# Altium schematic sheet CV060_POWER.SchDoc
size A4
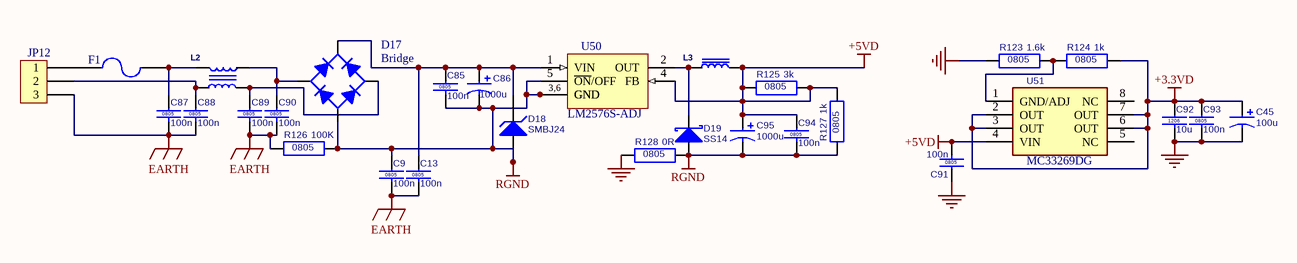
[diagram p0: CV060_POWER.SchDoc]

## Parts
C9  Case: 0805  [RC0805]  (hidden comment: 100n)
C13  Case: 0805  [RC0805]  (hidden comment: 100n)
C45  100u  [CEH12.5D5P2.5]
C85  Case: 0805  [RC0805]  (hidden comment: 100n)
C86  1000u  [CEH25D18P7.5]
C87  Case: 0805  [RC0805]  (hidden comment: 100n)
C88  Case: 0805  [RC0805]  (hidden comment: 100n)
C89  Case: 0805  [RC0805]  (hidden comment: 100n)
C90  Case: 0805  [RC0805]  (hidden comment: 100n)
C91  Case: 0805  [RC0805]  (hidden comment: 100n)
C92  Case: 1206  [RC1206]  (hidden comment: 10u)
C93  Case: 0805  [RC0805]  (hidden comment: 100n)
C94  Case: 0805  [RC0805]  (hidden comment: 100n)
C95  1000u  [CEH12.5D10P5.0]
D17  Bridge  [KBPM]
D18  Part Number: SMBJ24  [SMB]  (hidden comment: Zenner_diode)
D19  Part number: SS14  [SMA]  (hidden comment: Schottky_diode)
F1  RXEF135  [POLYSW_RXEF135]  (value not drawn)
JP12  Header 3pins  [PHENIX_5MM _3p3D]  (value not drawn)
L2  linear_filter1  [UU157-01]  (value not drawn)
L3  INDUCTOR2  [IH12.5D10P5.0]  (value not drawn)
R123  Case: 0805  [RC0805]  (hidden comment: 1.6k)
R124  Case: 0805  [RC0805]  (hidden comment: 1k)
R125  Case: 0805  [RC0805]  (hidden comment: 3k)
R126  Case: 0805  [RC0805]  (hidden comment: 100K)
R127  Case: 0805  [RC0805]  (hidden comment: 1k)
R128  Case: 0805  [RC0805]  (hidden comment: 0R)
U50  LM2576S-ADJ  [TO-263]
U51  MC33269DG  [SO-8]

## Nets
+3.3VD: C45.1 C92.1 C93.1 R124.2 U51.2(OUT) U51.3(OUT) U51.6(OUT) U51.7(OUT)
+5VD: C91.2 C94.1 C95.1 L3.2 R125.1 R125.2 R127.2 U50.4(FB) U51.4(VIN)
DGND: C45.2 C91.1 C92.2 C93.2 R123.1 R128.1
EARTH: C9.2 C13.2 C87.2 C88.2 C89.2 C90.2 JP12.3 R126.1
RGND: C9.1 C85.2 C86.2 C94.2 C95.2 D17.3(A) D18.2(A) D19.2(A) R126.2 R127.1 R128.2 U50.3(GND) U50.5(~{ON}/OFF) U50.6(GND)
NetC13_1: C13.1 C85.1 C86.1 D17.1(K) D18.1(K) U50.1(VIN)
NetC87_1: C87.1 F1.2 L2.1
NetC88_1: C88.1 JP12.2 L2.3
NetC89_1: C89.1 D17.2(C) L2.4
NetC90_1: C90.1 D17.4(C) L2.2
NetD19_1: D19.1(K) L3.1 U50.2(OUT)
NetF1_1: F1.1 JP12.1
NetR123_2: R123.2 R124.1 U51.1(GND/ADJ)

Not connected (* = marked no-connect by the designer): U51 5(NC) 8(NC)

## Notes on the sheet
- (in symbol LM2576S-ADJ) 3,6

## Library data of the parts
C9 C13 C85 C87-C91 C93 C94 = CC0805K-X5R-50V0-100N: Chip capacitor, 20p; Manufacturer: KEMET, YAGEO; Voltage: 50V; Tolerance: 10%; ROSH: Yes; Material: X5R; Package: 7" paper reel; Part number: CC0805K-X5R-50V0-100N; Suppliers: Avnet; Temperature: -55 - +125 C; Value: 100n; Supplier: Avnet-Abacus; Pb Free: Yes; Component Type: Standard; ComponentLink1Description: Manufacturer Link; ComponentLink2Description: Datasheet; ComponentLink2URL: http://www.yageo.com/pdf/UPY-GPHC_X5R_6.3V-to-50V_3.pdf; Published: 05.04.2010; Publisher: ppavlov
C45 = CEH12.5D5P2.5M-16V-100U: Electrolytic capacitor; Manufacturer: Panasonic; Manufacturer Part Number: C H12.5D5P2.5M-16V-100U; Voltage: 16V; Tolerance: 20%; Pb Free: Yes; Case: 12.5x5x2.5; Value: 100u; Part Number: CEH12.5D5P2.5M-16V-100U; Temperature: -55 - +105 C; Supplier: Megasan; MOQ: 500; Component Type: Standard; ComponentLink1Description: Manufacturer Link; ComponentLink2Description: Datasheet; ComponentLink2URL: http://industrial.panasonic.com/www-data/pdf/ABA0000/ABA0000CE22.pdf; Published: 11.12.2009; Publisher: ppavlov
C86 = CEH25D12.5P5.0M-50V-1000U: Electrolytic capacitor; Manufacturer: Panasonic; Voltage: 50V; Tolerance: 20%; Pb Free: Yes; Case: 25x18x7.5; Value: 1000u; Part Number: CEH25D12.5P5.0M-50V-1000U; Temperature: -55 - +105 C; Supplier: Megasan; Component Type: Standard; ComponentLink1Description: Manufacturer Link; ComponentLink2Description: Datasheet; Published: 29.06.2010; Publisher: ppavlov
C92 = CC1206K-X5R-10V0-10U0: Chip capacitor, 20p; Manufacturer: AVX; Manufacturer Part Number: AVX1206ZD106KAT2A; Voltage: 10V; Tolerance: 10%; ROSH: Yes; Material: X5R; Package: 7" paper reel; Part number: CC1206K-X5R-10V0-10U0; Suppliers: Avnet; Value: 10u; Stock ID: C083; Supplier: Avnet-Abacus; Pb Free: Yes; Component Type: Standard; ComponentLink1Description: Manufacturer Link; ComponentLink2Description: Datasheet; ComponentLink2URL: http://www.yageo.com/pdf/UPY-GPHC_X5R_6.3V-to-50V_3.pdf; Published: 11.11.2009; Publisher: tkondratyuk
C95 = CEH25D12.5P5.0M-35V-1000U: Electrolytic capacitor; Manufacturer: Panasonic; Manufacturer Part Number: EEUFC1V102; Voltage: 35V; Tolerance: 20%; Pb Free: Yes; Case: 25x12.5x5.0; Value: 1000u; Part Number: CEH25D12.5P5.0M-35V-1000U; Temperature: -55 - +105 C; Supplier: Megasan; MOQ: 500; Component Type: Standard; ComponentLink1Description: Manufacturer Link; ComponentLink2Description: Datasheet; ComponentLink2URL: http://industrial.panasonic.com/www-data/pdf/ABA0000/ABA0000CE22.pdf; Published: 07.01.2010; Publisher: ppavlov
D17 = 2KBP06M: Bridge 2A 600V; Pb Free: Yes; Part Number: 2KBP06M; Current: 2A; Voltage: 600V; Temperature: -65 - +125 C; Manufacturer Part Number: 2KBP06M; Component Type: Standard; ComponentLink1Description: Manufacturer Link; Case: KBPM; ComponentLink2Description: Datasheet; Published: 17.08.2010; Publisher: ppavlov
D18 = SMBJ24: Transient Voltage Suppressor; Manufacturer: Fairchild; Manufacturer Part Number: SMBJ24, SMBJ24A; Current: 15.4A; Voltage: 24V; Pb Free: Yes; Stock ID: D008a; Temperature: -55 - +150 C; Supplier: EBV; Component Type: Standard; ComponentLink1Description: Manufacturer Link; Case: SMB; ComponentLink2Description: Datasheet; ComponentLink2URL: http://www.datasheetcatalog.org/datasheet/mcc/SMBJ24C.pdf; Published: 16.11.2009; Publisher: tkondratyuk
D19 = SS14: Surface Mount Schottky Barrier Rectifier; Manufacturer: Fairchild, Vishay; Current: 1A; Voltage: 40V; Pb Free: Yes; Stock ID: D034; Temperature: -65 - +125 C; Supplier: EBV; Manufacturer Part Number: SS14; Component Type: Standard; ComponentLink1Description: Manufacturer Link; Case: SMA; ComponentLink2Description: Datasheet; ComponentLink2URL: http://www.datasheetcatalog.org/datasheet/vishay/ss12.pdf; Published: 16.11.2009; Publisher: tkondratyuk
F1 = RXEF135: Polyswitch RXEF135 fuse; Current: 1.2A; Voltage: 72V; Pb Free: Yes; Part Number: RXEF135; Temperature: -55 - +150 C; Manufacturer: Polyswitch; Manufacturer Part Number: RXEF135; Component Type: Standard; ComponentLink1Description: Manufacturer Link; Case: RXEF135; ComponentLink2Description: Datasheet; Published: 27.01.2010; Publisher: ppavlov
JP12 = 2EDGR-5.0-03P-14: 5.08mm angled 3pins receptabe; Pins number: 5; Pb Free: Yes; Part Number: 2EDGR-5.0-03P-14; Temperature: -40 - +105 C; Supplier: Biakom; Manufacturer Part Number: 2EDGR-5.0-03P-14; Component Type: Standard; ComponentLink1Description: Manufacturer Link; Case: PHENIX_5MM _3p3D; ComponentLink2Description: Datasheet; Published: 17.08.2010; Publisher: ppavlov
L2 = UU157-01: Linear filter; Manufacturer Part Number: RB0912-101KLA; DC Current: 1A; Tolerance: 20%; DC Resistance: 0,1; Pb Free: Yes; Author: PPavlov; Part Number: UU157-01; Temperature: -40 - +105 C; Component Type: Standard; ComponentLink1Description: Manufacturer Link; Case: UU157-01; ComponentLink2Description: Datasheet; Published: 29.06.2010; Publisher: ppavlov
L3 = RB0914-151KLA: Through hole Power Inductor; DC Current: 0.8A; Tolerance: 20%; DC Resistance: 0,1; Pb Free: Yes; Value: 150 uH; Author: PPavlov; Part Number: RB0914-151KLA; Temperature: -40 - +105 C; Manufacturer Part Number: RB0914-151KLA; Component Type: Standard; ComponentLink1Description: Manufacturer Link; Case: IH12.5D10P5.0; ComponentLink2Description: Datasheet; Published: 29.06.2010; Publisher: ppavlov
R123 = RC0805F-1K60: Chip resistor; Manufacturer: PHILIPS, SAMSUNG; Voltage: 200V; Power: 1/10W; Tolerance: 1%; Pb Free: Yes; Value: 1.6k; Part Number: RC0805F-1K60; Temperature: -55 - +155 C; Supplier: Megasan; Component Type: Standard; ComponentLink1Description: Manufacturer Link; ComponentLink2Description: Datasheet; ComponentLink2URL: http://www.yageo.com/pdf/PYu-RC1206_51_RoHS_L_4.pdf; Published: 11.12.2009; Publisher: ppavlov
R124 R127 = RC0805F-1K00: Chip resistor; Manufacturer: PHILIPS, SAMSUNG; Voltage: 200V; Power: 1/10W; Tolerance: 1%; Pb Free: Yes; Value: 1k; Part Number: RC0805F-1K00; Temperature: -55 - +155 C; Supplier: Megasan; Component Type: Standard; ComponentLink1Description: Manufacturer Link; ComponentLink2Description: Datasheet; ComponentLink2URL: http://www.yageo.com/pdf/PYu-RC1206_51_RoHS_L_4.pdf; Published: 11.12.2009; Publisher: ppavlov
R125 = RC0805F-3K00: Chip resistor; Manufacturer: PHILIPS, SAMSUNG; Voltage: 200V; Power: 1/10W; Tolerance: 1%; Pb Free: Yes; Value: 3k; Part Number: RC0805F-3K00; Temperature: -55 - +155 C; Supplier: Megasan; Component Type: Standard; ComponentLink1Description: Manufacturer Link; ComponentLink2Description: Datasheet; ComponentLink2URL: http://www.yageo.com/pdf/PYu-RC1206_51_RoHS_L_4.pdf; Published: 11.12.2009; Publisher: ppavlov
R126 = RC0805F-100K: Chip resistor; Manufacturer: PHILIPS, SAMSUNG; Voltage: 200V; Power: 1/10W; Tolerance: 1%; Pb Free: Yes; Value: 100K; Part Number: RC0805F-100K; Temperature: -55 - +155 C; Supplier: Megasan; Component Type: Standard; ComponentLink1Description: Manufacturer Link; ComponentLink2Description: Datasheet; ComponentLink2URL: http://www.yageo.com/pdf/PYu-RC1206_51_RoHS_L_4.pdf; Published: 11.12.2009; Publisher: ppavlov
R128 = RC0805F-000R: Chip resistor; Manufacturer: PHILIPS, SAMSUNG; Voltage: 200V; Power: 1/10W; Tolerance: 1%; Pb Free: Yes; Value: 0R; Part Number: RC0805F-000R; Temperature: -55 - +155 C; Supplier: Megasan; Component Type: Standard; ComponentLink1Description: Manufacturer Link; ComponentLink2Description: Datasheet; ComponentLink2URL: http://www.yageo.com/pdf/PYu-RC1206_51_RoHS_L_4.pdf; Published: 11.12.2009; Publisher: ppavlov
U50 = LM2576S-ADJ: 3A Step-Down Voltage Regulator; Manufacturer: National semiconductor; Pb Free: Yes; Part Number: LM2576S-ADJ; Temperature: -40 - +125 C; Manufacturer Part Number: LM2576S-ADJ; Component Type: Standard; ComponentLink1Description: Manufacturer Link; Case: TO-263; ComponentLink2Description: Datasheet; Published: 07.01.2010; Publisher: ppavlov
U51 = MC33269DG: LDO 800ma ADJ; Manufacturer: ON Semiconductor; Pb Free: Yes; Part Number: MC33269DG; Temperature: -40 - +150 C; Manufacturer Part Number: MC33269DG; Component Type: Standard; ComponentLink1Description: Manufacturer Link; Case: SO-8; ComponentLink2Description: Datasheet; ComponentLink2URL: http://www.onsemi.com/PowerSolutions/product.do?id=MC33269DG; Published: 07.01.2010; Publisher: ppavlov